# EasyEDA Pro project P1(1).epro

# Schematic Schematic1
Create Date: 2023-07-21; Page Name: P1; Project Name: 230721-反原理图; Schematic Name: Schematic1; Update Date: 2023-07-21; Company: 嘉立创EDA; Page Size: A4; Version: V1.0
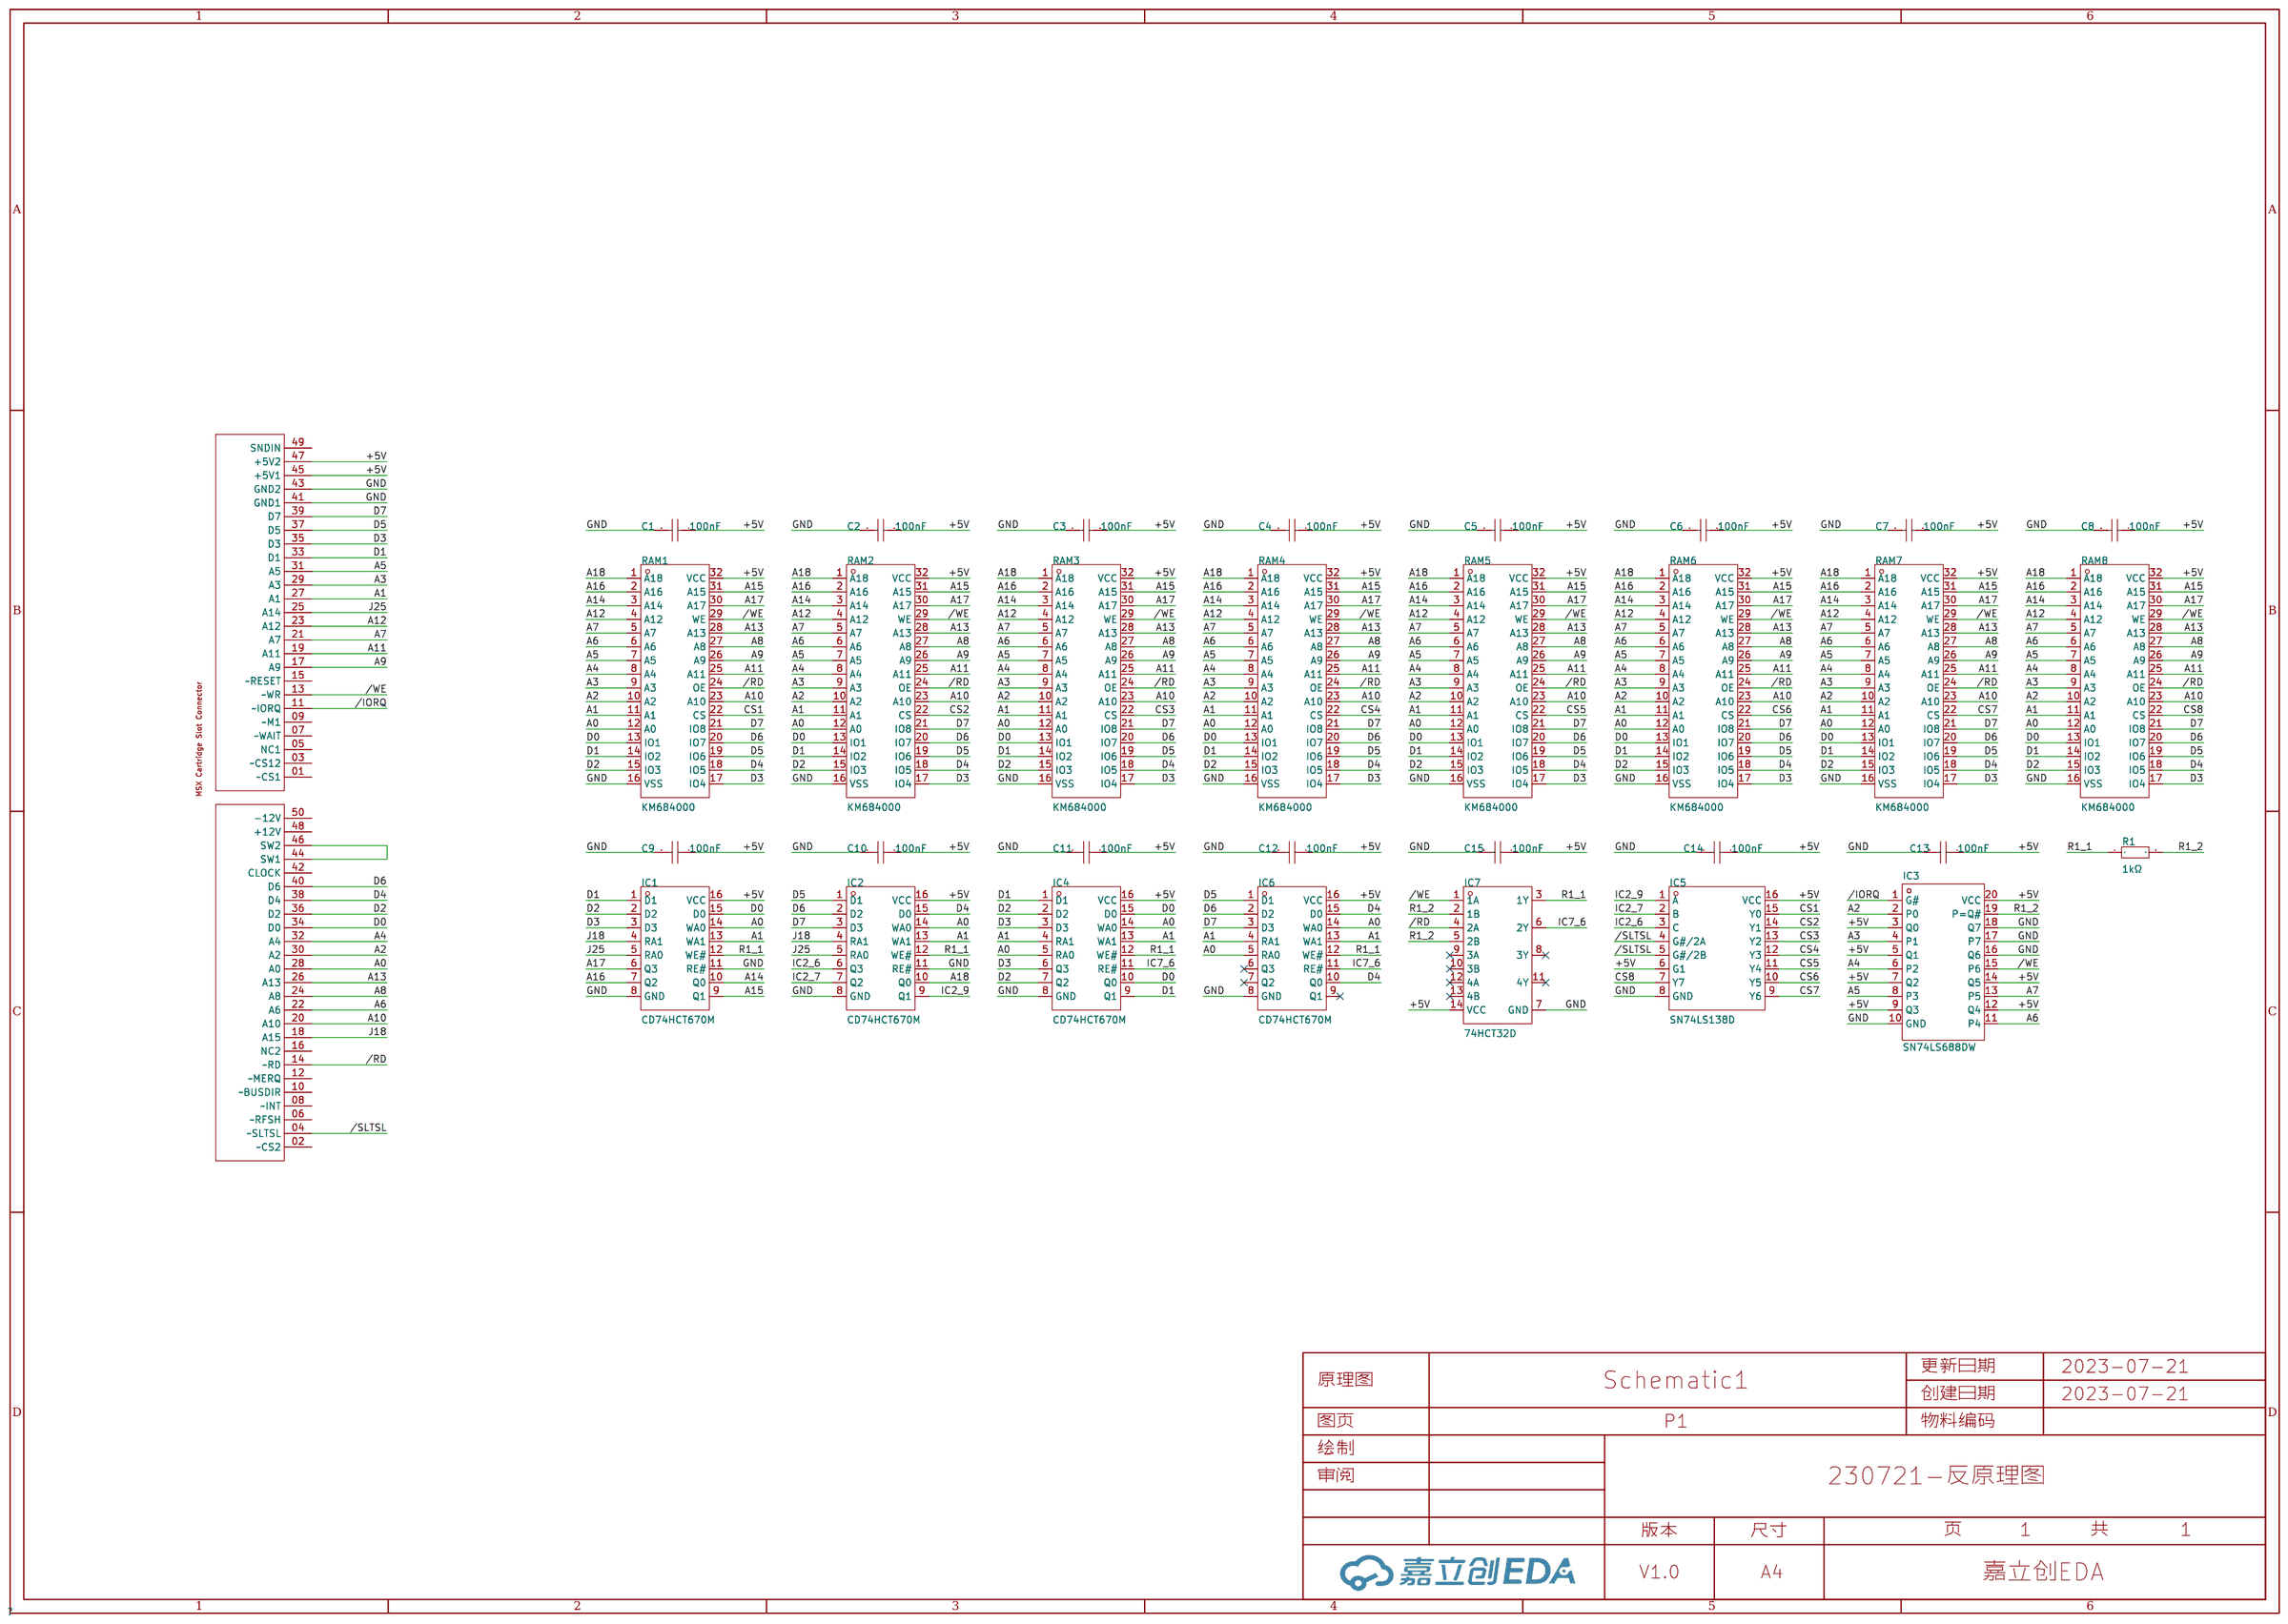
[diagram p0: schematic sheet]

## Parts
C1  100nF  [C0805]
C2  100nF  [C0805]
C3  100nF  [C0805]
C4  100nF  [C0805]
C5  100nF  [C0805]
C6  100nF  [C0805]
C7  100nF  [C0805]
C8  100nF  [C0805]
C9  100nF  [C0805]
C10  100nF  [C0805]
C11  100nF  [C0805]
C12  100nF  [C0805]
C13  100nF  [C0805]
C14  100nF  [C0805]
C15  100nF  [C0805]
IC1  CD74HCT670M  [SOIC-16_L9.9-W3.9-P1.27-LS6.0-BL]
IC2  CD74HCT670M  [SOIC-16_L9.9-W3.9-P1.27-LS6.0-BL]
IC3  SN74LS688DW  [SOIC-20_L12.8-W7.5-P1.27-LS10.3-BL]
IC4  CD74HCT670M  [SOIC-16_L9.9-W3.9-P1.27-LS6.0-BL]
IC5  SN74LS138D  [SOIC-16_L9.9-W3.9-P1.27-LS6.0-BL]
IC6  CD74HCT670M  [SOIC-16_L9.9-W3.9-P1.27-LS6.0-BL]
IC7  74HCT32D  [SOIC-14_L8.6-W3.9-P1.27-LS6.0-BL]
J2  MSX_SLOT_CON
R1  1kΩ  [R0805]
RAM1  KM684000  [SOP-32_L20.9-W11.4-P1.27-LS14.12-BL]
RAM2  KM684000  [SOP-32_L20.9-W11.4-P1.27-LS14.12-BL]
RAM3  KM684000  [SOP-32_L20.9-W11.4-P1.27-LS14.12-BL]
RAM4  KM684000  [SOP-32_L20.9-W11.4-P1.27-LS14.12-BL]
RAM5  KM684000  [SOP-32_L20.9-W11.4-P1.27-LS14.12-BL]
RAM6  KM684000  [SOP-32_L20.9-W11.4-P1.27-LS14.12-BL]
RAM7  KM684000  [SOP-32_L20.9-W11.4-P1.27-LS14.12-BL]
RAM8  KM684000  [SOP-32_L20.9-W11.4-P1.27-LS14.12-BL]

## Library data of the parts
C1-C15 = CC0805KRX7R9BB104: 容值:100nF;精度:±10%;额定电压:50V;材质(温度系数):X7R;; LCSC Part Name: 100nF ±10% 50V; Supplier Part: C49678; Manufacturer: YAGEO(国巨); Supplier Footprint: 0805; JLCPCB Part Class: 基础库; Datasheet: https://atta.szlcsc.com/upload/public/pdf/source/20151026/1457707504898.pdf; Supplier: LCSC; Tolerance: ±10%; Voltage Rated: 50V; Temperature Coefficient: X7R
IC1 IC2 IC4 IC6 = CD74HCT670M: 高速 CMOS 逻辑 4 x 4 寄存器文件 16-SOIC -55 to 125; Supplier Part: C2863553; Manufacturer: TI(德州仪器); Supplier Footprint: SOIC-16; JLCPCB Part Class: 扩展库; Datasheet: https://atta.szlcsc.com/upload/public/pdf/source/20230221/E33A9A7B6216A5028783837EE760C750.pdf; Supplier: LCSC
IC3 = SN74LS688DW: 具有使能端的 8 位等值/幅度比较器 (P=Q) 20-SOIC 0 to 70; Supplier Part: C1523716; Manufacturer: TI(德州仪器); Supplier Footprint: SOIC-20; JLCPCB Part Class: 扩展库; Datasheet: https://atta.szlcsc.com/upload/public/pdf/source/20230221/A5B189CF5F3CF0485C203EA6A0730D63.pdf; Supplier: LCSC
IC5 = SN74LS138D: 类型:解码器/多路解器;低电平输出电流(IOL):8mA;高电平输出电流(IOH):400uA;供电电源:单电源;供电电压:4.75V~5.25V;工作温度:0℃~+70℃;; LCSC Part Name: 解码器/多路解器 单电源 4.75V~5.25V; Supplier Part: C1547254; Manufacturer: TI(德州仪器); Supplier Footprint: SOIC-16; JLCPCB Part Class: 扩展库; Datasheet: https://atta.szlcsc.com/upload/public/pdf/source/20210601/F9E76C2D539721A28878E6B548D57862.pdf; Supplier: LCSC; Type: 解码器/多路解器; Current-OutputLow: 8mA; Current-OutputHigh: 400uA; Voltage Supply Source: 单电源; Supply Voltage: 4.75V~5.25V; Operating temperature: 0℃~+70℃
IC7 = 74HCT32D: 逻辑类型:或门;通道数:4;电源电压:4.5V~5.5V;静态电流(最大值):1uA;最大传播延迟:18ns@5.5V,50pF;; Supplier Part: C4469360; Manufacturer: TOSHIBA(东芝); Supplier Footprint: SOIC-14; JLCPCB Part Class: 扩展库; Supplier: LCSC; Series: 74HCT; Logic Gate Type: 或门; Number of Channels: 4; Supply Voltage: 4.5V~5.5V; Quiescent Current (Max): 1uA; Sink Current: 4mA; Source Current: 4mA; High Level Range (VIH): 2V; Low Level Range (VIL): 800mV; Propagation Delay Time: 18ns@5.5V,50pF; Operating Temperature: -40℃~+85℃
J2 = msx2proto-eagle-import_MSX_SLOT_CON
R1 = 0805W8F1001T5E: 电阻类型:厚膜电阻;阻值:1kΩ;精度:±1%;功率:125mW;; LCSC Part Name: 1kΩ ±1% 125mW; Supplier Part: C17513; Manufacturer: UNI-ROYAL(厚声); Supplier Footprint: 0805; JLCPCB Part Class: 基础库; Datasheet: https://atta.szlcsc.com/upload/public/pdf/source/20200306/C422600_1E6D84923E4A46A82E41ADD87F860B5C.pdf; Supplier: LCSC; Type: 厚膜电阻; Tolerance: ±1%; Power(Watts): 125mW; Temperature Coefficient: ±100ppm/℃; Overload Voltage (Max): 150V; Operating Temperature Range: -55℃~+155℃
RAM1-RAM8 = KM684000: 存储器类型:-;存储器容量:-;存储器接口类型:-;工作电压:-;; Supplier Footprint: SOP-32; JLCPCB Part Class: 扩展库; Datasheet: https://atta.szlcsc.com/upload/public/pdf/source/20210707/C2829319_969987DA588CA4FC142F02D9774026E5.pdf

## Nets
+5V: C1.1 C2.1 C3.1 C4.1 C5.1 C6.1 C7.1 C8.1 C9.1 C10.1 C11.1 C12.1 C13.1 C14.1 C15.1 IC1.16(VCC) IC2.16(VCC) IC3.3(Q0) IC3.5(Q1) IC3.7(Q2) IC3.9(Q3) IC3.12(Q4) IC3.14(Q5) IC3.20(VCC) IC4.16(VCC) IC5.6(G1) IC5.16(VCC) IC6.16(VCC) IC7.14(VCC) J2.45(+5V1) J2.47(+5V2) RAM1.32(VCC) RAM2.32(VCC) RAM3.32(VCC) RAM4.32(VCC) RAM5.32(VCC) RAM6.32(VCC) RAM7.32(VCC) RAM8.32(VCC)
GND: C1.2 C2.2 C3.2 C4.2 C5.2 C6.2 C7.2 C8.2 C9.2 C10.2 C11.2 C12.2 C13.2 C14.2 C15.2 IC1.8(GND) IC1.11(RE#) IC2.8(GND) IC2.11(RE#) IC3.10(GND) IC3.16(Q6) IC3.17(P7) IC3.18(Q7) IC4.8(GND) IC5.8(GND) IC6.8(GND) IC7.7(GND) J2.41(GND1) J2.43(GND2) RAM1.16(VSS) RAM2.16(VSS) RAM3.16(VSS) RAM4.16(VSS) RAM5.16(VSS) RAM6.16(VSS) RAM7.16(VSS) RAM8.16(VSS)
/IORQ: IC3.1(G#) J2.11(~IORQ)
/RD: IC7.4(2A) J2.14(~RD) RAM1.24(OE) RAM2.24(OE) RAM3.24(OE) RAM4.24(OE) RAM5.24(OE) RAM6.24(OE) RAM7.24(OE) RAM8.24(OE)
/SLTSL: IC5.4(G#/2A) IC5.5(G#/2B) J2.04(~SLTSL)
/WE: IC3.15(P6) IC7.1(1A) J2.13(~WR) RAM1.29(WE) RAM2.29(WE) RAM3.29(WE) RAM4.29(WE) RAM5.29(WE) RAM6.29(WE) RAM7.29(WE) RAM8.29(WE)
A0: IC1.14(WA0) IC2.14(WA0) IC4.5(RA0) IC4.14(WA0) IC6.5(RA0) IC6.14(WA0) J2.28(A0) RAM1.12(A0) RAM2.12(A0) RAM3.12(A0) RAM4.12(A0) RAM5.12(A0) RAM6.12(A0) RAM7.12(A0) RAM8.12(A0)
A1: IC1.13(WA1) IC2.13(WA1) IC4.4(RA1) IC4.13(WA1) IC6.4(RA1) IC6.13(WA1) J2.27(A1) RAM1.11(A1) RAM2.11(A1) RAM3.11(A1) RAM4.11(A1) RAM5.11(A1) RAM6.11(A1) RAM7.11(A1) RAM8.11(A1)
A2: IC3.2(P0) J2.30(A2) RAM1.10(A2) RAM2.10(A2) RAM3.10(A2) RAM4.10(A2) RAM5.10(A2) RAM6.10(A2) RAM7.10(A2) RAM8.10(A2)
A3: IC3.4(P1) J2.29(A3) RAM1.9(A3) RAM2.9(A3) RAM3.9(A3) RAM4.9(A3) RAM5.9(A3) RAM6.9(A3) RAM7.9(A3) RAM8.9(A3)
A4: IC3.6(P2) J2.32(A4) RAM1.8(A4) RAM2.8(A4) RAM3.8(A4) RAM4.8(A4) RAM5.8(A4) RAM6.8(A4) RAM7.8(A4) RAM8.8(A4)
A5: IC3.8(P3) J2.31(A5) RAM1.7(A5) RAM2.7(A5) RAM3.7(A5) RAM4.7(A5) RAM5.7(A5) RAM6.7(A5) RAM7.7(A5) RAM8.7(A5)
A6: IC3.11(P4) J2.22(A6) RAM1.6(A6) RAM2.6(A6) RAM3.6(A6) RAM4.6(A6) RAM5.6(A6) RAM6.6(A6) RAM7.6(A6) RAM8.6(A6)
A7: IC3.13(P5) J2.21(A7) RAM1.5(A7) RAM2.5(A7) RAM3.5(A7) RAM4.5(A7) RAM5.5(A7) RAM6.5(A7) RAM7.5(A7) RAM8.5(A7)
A8: J2.24(A8) RAM1.27(A8) RAM2.27(A8) RAM3.27(A8) RAM4.27(A8) RAM5.27(A8) RAM6.27(A8) RAM7.27(A8) RAM8.27(A8)
A9: J2.17(A9) RAM1.26(A9) RAM2.26(A9) RAM3.26(A9) RAM4.26(A9) RAM5.26(A9) RAM6.26(A9) RAM7.26(A9) RAM8.26(A9)
A10: J2.20(A10) RAM1.23(A10) RAM2.23(A10) RAM3.23(A10) RAM4.23(A10) RAM5.23(A10) RAM6.23(A10) RAM7.23(A10) RAM8.23(A10)
A11: J2.19(A11) RAM1.25(A11) RAM2.25(A11) RAM3.25(A11) RAM4.25(A11) RAM5.25(A11) RAM6.25(A11) RAM7.25(A11) RAM8.25(A11)
A12: J2.23(A12) RAM1.4(A12) RAM2.4(A12) RAM3.4(A12) RAM4.4(A12) RAM5.4(A12) RAM6.4(A12) RAM7.4(A12) RAM8.4(A12)
A13: J2.26(A13) RAM1.28(A13) RAM2.28(A13) RAM3.28(A13) RAM4.28(A13) RAM5.28(A13) RAM6.28(A13) RAM7.28(A13) RAM8.28(A13)
A14: IC1.10(Q0) RAM1.3(A14) RAM2.3(A14) RAM3.3(A14) RAM4.3(A14) RAM5.3(A14) RAM6.3(A14) RAM7.3(A14) RAM8.3(A14)
A15: IC1.9(Q1) RAM1.31(A15) RAM2.31(A15) RAM3.31(A15) RAM4.31(A15) RAM5.31(A15) RAM6.31(A15) RAM7.31(A15) RAM8.31(A15)
A16: IC1.7(Q2) RAM1.2(A16) RAM2.2(A16) RAM3.2(A16) RAM4.2(A16) RAM5.2(A16) RAM6.2(A16) RAM7.2(A16) RAM8.2(A16)
A17: IC1.6(Q3) RAM1.30(A17) RAM2.30(A17) RAM3.30(A17) RAM4.30(A17) RAM5.30(A17) RAM6.30(A17) RAM7.30(A17) RAM8.30(A17)
A18: IC2.10(Q0) RAM1.1(A18) RAM2.1(A18) RAM3.1(A18) RAM4.1(A18) RAM5.1(A18) RAM6.1(A18) RAM7.1(A18) RAM8.1(A18)
CS1: IC5.15(Y0) RAM1.22(CS)
CS2: IC5.14(Y1) RAM2.22(CS)
CS3: IC5.13(Y2) RAM3.22(CS)
CS4: IC5.12(Y3) RAM4.22(CS)
CS5: IC5.11(Y4) RAM5.22(CS)
CS6: IC5.10(Y5) RAM6.22(CS)
CS7: IC5.9(Y6) RAM7.22(CS)
CS8: IC5.7(Y7) RAM8.22(CS)
D0: IC1.15(D0) IC4.10(Q0) IC4.15(D0) J2.34(D0) RAM1.13(IO1) RAM2.13(IO1) RAM3.13(IO1) RAM4.13(IO1) RAM5.13(IO1) RAM6.13(IO1) RAM7.13(IO1) RAM8.13(IO1)
D1: IC1.1(D1) IC4.1(D1) IC4.9(Q1) J2.33(D1) RAM1.14(IO2) RAM2.14(IO2) RAM3.14(IO2) RAM4.14(IO2) RAM5.14(IO2) RAM6.14(IO2) RAM7.14(IO2) RAM8.14(IO2)
D2: IC1.2(D2) IC4.2(D2) IC4.7(Q2) J2.36(D2) RAM1.15(IO3) RAM2.15(IO3) RAM3.15(IO3) RAM4.15(IO3) RAM5.15(IO3) RAM6.15(IO3) RAM7.15(IO3) RAM8.15(IO3)
D3: IC1.3(D3) IC4.3(D3) IC4.6(Q3) J2.35(D3) RAM1.17(IO4) RAM2.17(IO4) RAM3.17(IO4) RAM4.17(IO4) RAM5.17(IO4) RAM6.17(IO4) RAM7.17(IO4) RAM8.17(IO4)
D4: IC2.15(D0) IC6.10(Q0) IC6.15(D0) J2.38(D4) RAM1.18(IO5) RAM2.18(IO5) RAM3.18(IO5) RAM4.18(IO5) RAM5.18(IO5) RAM6.18(IO5) RAM7.18(IO5) RAM8.18(IO5)
D5: IC2.1(D1) IC6.1(D1) J2.37(D5) RAM1.19(IO6) RAM2.19(IO6) RAM3.19(IO6) RAM4.19(IO6) RAM5.19(IO6) RAM6.19(IO6) RAM7.19(IO6) RAM8.19(IO6)
D6: IC2.2(D2) IC6.2(D2) J2.40(D6) RAM1.20(IO7) RAM2.20(IO7) RAM3.20(IO7) RAM4.20(IO7) RAM5.20(IO7) RAM6.20(IO7) RAM7.20(IO7) RAM8.20(IO7)
D7: IC2.3(D3) IC6.3(D3) J2.39(D7) RAM1.21(IO8) RAM2.21(IO8) RAM3.21(IO8) RAM4.21(IO8) RAM5.21(IO8) RAM6.21(IO8) RAM7.21(IO8) RAM8.21(IO8)
IC2_6: IC2.6(Q3) IC5.3(C)
IC2_7: IC2.7(Q2) IC5.2(B)
IC2_9: IC2.9(Q1) IC5.1(A)
IC7_6: IC4.11(RE#) IC6.11(RE#) IC7.6(2Y)
J18: IC1.4(RA1) IC2.4(RA1) J2.18(A15)
J25: IC1.5(RA0) IC2.5(RA0) J2.25(A14)
R1_1: IC1.12(WE#) IC2.12(WE#) IC4.12(WE#) IC6.12(WE#) IC7.3(1Y) R1.1
R1_2: IC3.19(P=Q#) IC7.2(1B) IC7.5(2B) R1.2
Net-(J2-44): J2.44(SW1) J2.46(SW2)

Not connected (* = marked no-connect by the designer): IC6 6(Q3)* 7(Q2)* 9(Q1)*; IC7 8(3Y)* 9(3A)* 10(3B)* 11(4Y)* 12(4A)* 13(4B)*; J2 01(~CS1) 02(~CS2) 03(~CS12) 05(NC1) 06(~RFSH) 07(~WAIT) 08(~INT) 09(~M1) 10(~BUSDIR) 12(~MERQ) 15(~RESET) 16(NC2) 42(CLOCK) 48(+12V) 49(SNDIN) 50(-12V)
